# EAGLE design InitialTransceivers (EAGLE 7.1.0)
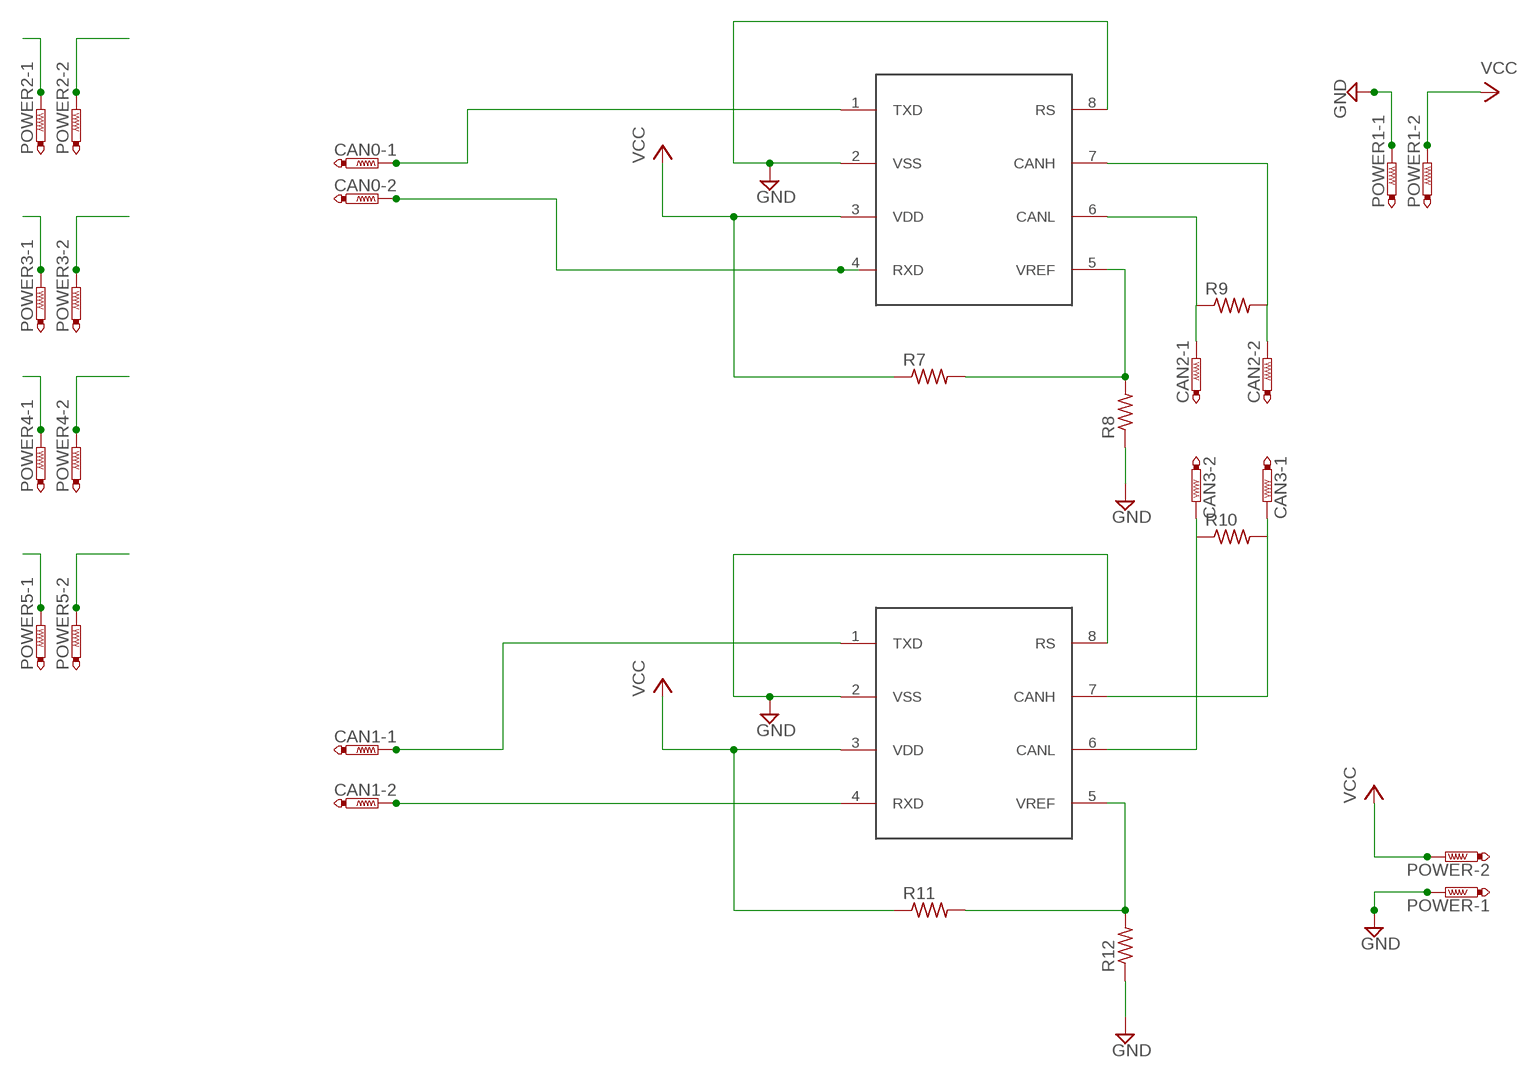
[diagram p0: schematic, sheet 1]

## Parts
CAN0  PTR2  [P2-38-17]
CAN1  PTR2  [P2-38-17]
CAN2  PTR2  [P2-38-17]
CAN3  PTR2  [P2-38-17]
POWER  PTR2  [P2-38-17]
POWER1  PTR2  [P2-38-17]
POWER2  PTR2  [P2-38-17]
POWER3  PTR2  [P2-38-17]
POWER4  PTR2  [P2-38-17]
POWER5  PTR2  [P2-38-17]
R7  R-US_0204/5  [0204/5]
R8  R-US_0204/5  [0204/5]
R9  R-US_0204/5  [0204/5]
R10  R-US_0204/5  [0204/5]
R11  R-US_0204/5  [0204/5]
R12  R-US_0204/5  [0204/5]
U$2  MCP2551-DIP  [DIL08]
U$3  MCP2551-DIP  [DIL08]

## Nets
A0: POWER2.TP-1 POWER3.TP-1
A1: POWER2.TP-2 POWER3.TP-2
A2: POWER4.TP-1 POWER5.TP-1
A3: POWER4.TP-2 POWER5.TP-2
CH: CAN3.TP-1 R10.2 U$3.7(CANH)
CL: CAN3.TP-2 R10.1 U$3.6(CANL)
GND: POWER1.TP-1 POWER.TP-1 R8.1 R12.1 U$2.2(VSS) U$2.8(RS) U$3.2(VSS) U$3.8(RS)
N$1: CAN2.TP-1 R9.1 U$2.6(CANL)
N$2: CAN2.TP-2 R9.2 U$2.7(CANH)
N$3: R7.2 R8.2 U$2.5(VREF)
N$7: R11.2 R12.2 U$3.5(VREF)
RX1: CAN0.TP-2 U$2.4(RXD)
RX2: CAN1.TP-2 U$3.4(RXD)
TX1: CAN0.TP-1 U$2.1(TXD)
TX2: CAN1.TP-1 U$3.1(TXD)
VCC: POWER1.TP-2 POWER.TP-2 R7.1 R11.1 U$2.3(VDD) U$3.3(VDD)

## Library data of the parts
CAN0 CAN1-CAN3 POWER POWER1-POWER5 = testpad:PTR2: TEST PIN
R7-R12 = resistor:R-US_: RESISTOR, American symbol
U$2 U$3 = Dash parts:MCP2551-DIP

## Board
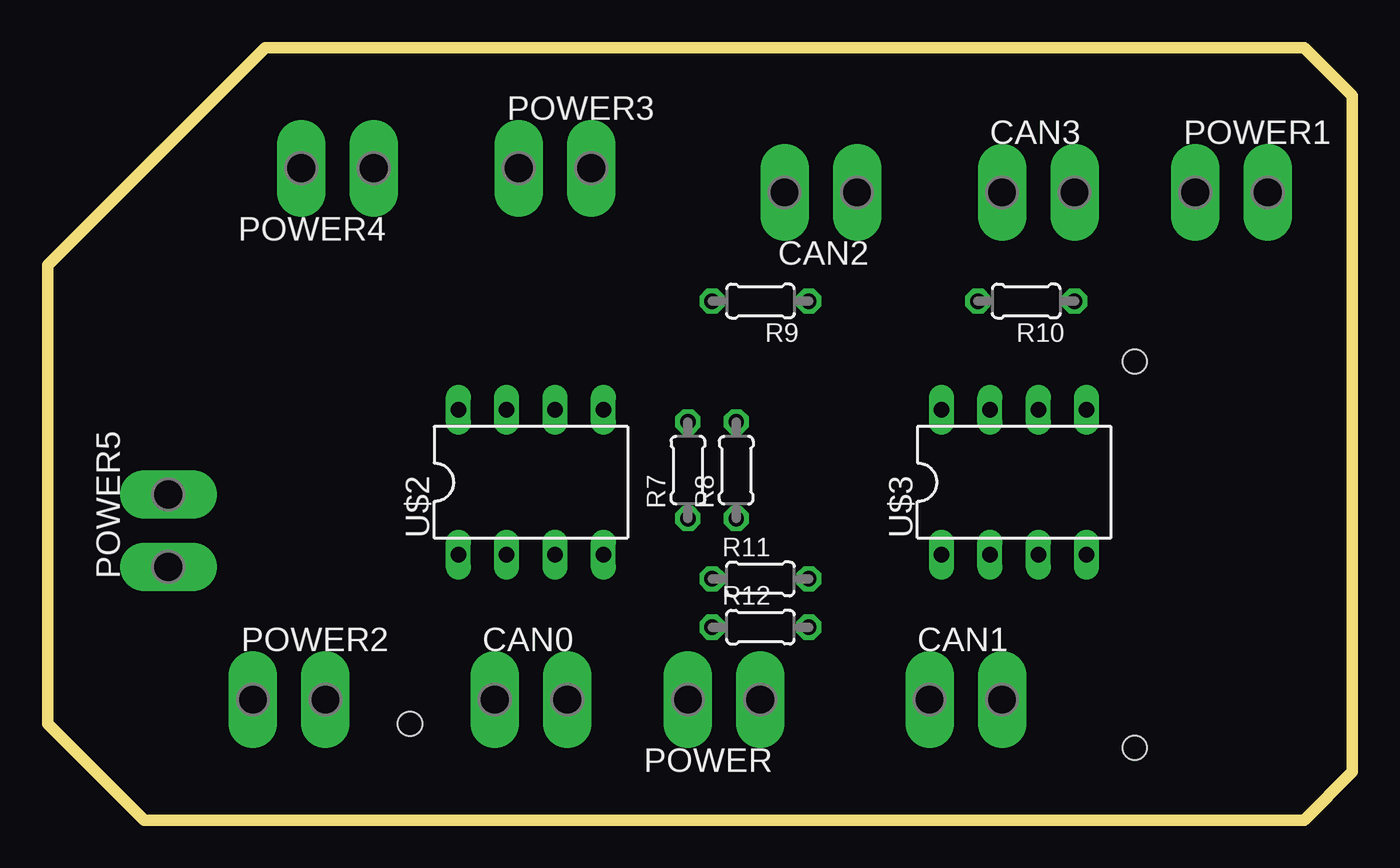
[diagram p1: board, top side]
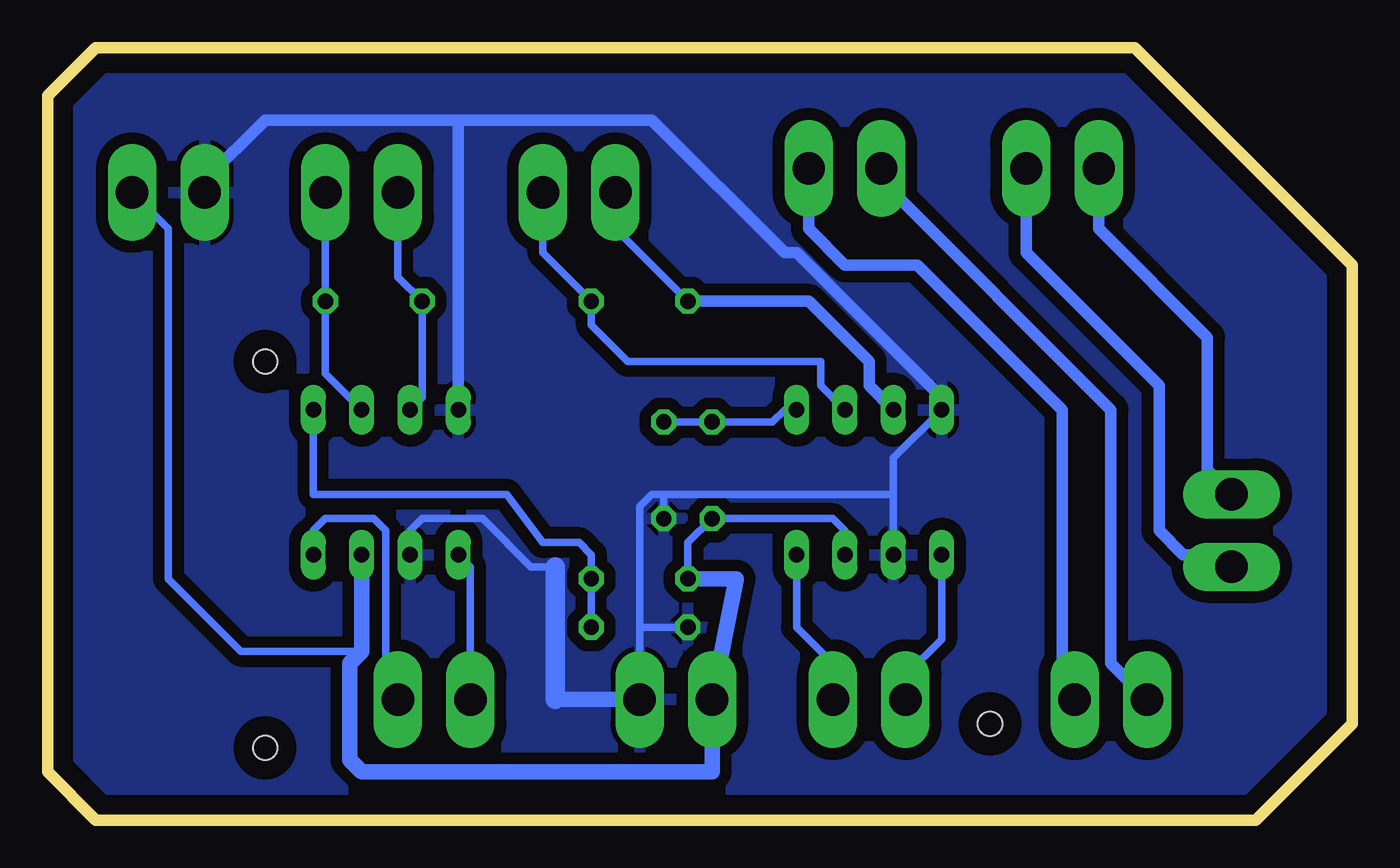
[diagram p2: board, bottom side, seen from below]

Size 68.58 x 40.64 mm. Coordinates in mm from the lower left corner, seen from the top.
Outline: 0,5.08 0,29.21 11.43,40.64 66.04,40.64 68.58,38.1 68.58,2.54 66.04,0 5.08,0 0,5.08
Copper layers (1*16): Top 0.035mm / dielectric 1.5mm / Bottom 0.035mm
Design rules "default": minimum track width 10mil, minimum drill 24mil, track to track 8mil, track to pad 8mil, pad to pad 8mil, via to via 8mil, smd to smd 8mil, copper to edge 40mil, drill to drill 8mil, minimum pad ring 10mil, minimum via ring 8mil, stop-mask expansion 4mil, vias tented up to drill 0mil, thermal gap 10mil
Holes 1.27 mm at 19.05,5.08 57.15,24.13 57.15,3.81

### Footprints (pad centres in the part's own frame; a part is rotated, then mirrored left to right if it is on the bottom)
P2-38-17 = drill 1.702 pad 2.121 long: TP-1 -1.905,0; TP-2 1.905,0
0204/5 = drill 0.813 octagon: 1 -2.54,0; 2 2.54,0
DIL08 = drill 0.813 long: 1 -3.81,-3.81; 2 -1.27,-3.81; 3 1.27,-3.81; 4 3.81,-3.81; 5 3.81,3.81; 6 1.27,3.81; 7 -1.27,3.81; 8 -3.81,3.81

### Placement (x,y rotation side)
CAN0  25.4,6.35 0 top
CAN1  48.26,6.35 0 top
CAN2  40.64,33.02 180 top
CAN3  52.07,33.02 0 top
POWER  35.56,6.35 180 top
POWER1  62.23,33.02 0 top
POWER2  12.7,6.35 0 top
POWER3  26.67,34.29 0 top
POWER4  15.24,34.29 180 top
POWER5  6.35,15.24 90 top
R7  33.66,18.41 90 top
R8  36.2,18.41 90 top
R9  37.47,27.3 180 top
R10  51.44,27.3 180 top
R11  37.47,12.7 0 top
R12  37.47,10.16 0 top
U$2  25.4,17.78 0 top
U$3  50.8,17.78 0 top

### Tracks (layer width: path | path; a pad name or v marks a point on that pad's centre or on a via)
A0
  Bottom 0.61: POWER2.TP-1 12.7,8.26 12.7,21.59 24.77,33.66 POWER3.TP-1
A1
  Bottom 0.61: POWER2.TP-2 15.24,6.98 15.24,21.59 22.86,29.21 26.67,29.21 28.57,31.11 POWER3.TP-2
A2
  Bottom 0.61: POWER5.TP-1 6.98,13.97 8.89,13.97 10.16,15.24 10.16,22.86 17.14,29.84 POWER4.TP-1
A3
  Bottom 0.61: POWER5.TP-2 7.62,18.41 7.62,25.4 13.34,31.11 POWER4.TP-2
CH
  Bottom 0.406: U$3.7 48.9,22.22 R10.2 50.17,28.57 CAN3.TP-1
CL
  Bottom 0.406: U$3.6 53.98,23.5 R10.1 CAN3.TP-2
GND
  Bottom 0.406: U$2.8 24.13,19.05 24.13,17.14 | 24.13,17.14 U$2.2 | POWER.TP-1 37.47,10.16 | 37.47,10.16 37.47,16.51 36.83,17.14 36.2,17.14 | 36.2,17.14 24.13,17.14 | R12.1 37.47,10.16 | R8.1 36.2,17.14 | U$3.2 49.53,15.24 48.9,15.88 45.72,15.88 43.18,13.33 41.91,13.33
  Bottom 0.61: POWER1.TP-1 60.33,33.66 57.15,36.83 46.99,36.83 | 46.99,36.83 36.83,36.83 29.85,29.84 29.21,29.84 21.59,22.22 U$2.8 | U$3.8 46.99,36.83
  Bottom 0.813: 41.91,6.35 POWER.TP-1
  Bottom 1.016: 41.91,13.33 41.91,6.35
  pour Bottom (isolate 0.61): 1.27,0 0,29.21 11.43,40.64 66.04,40.64 68.58,38.1 68.58,2.54 66.04,0
N$1
  Bottom 0.406: U$2.6 27.94,22.86 27.94,24.13 38.1,24.13 40.01,26.04 R9.1 42.55,29.84 CAN2.TP-1
N$2
  Bottom 0.406: R9.2 38.73,31.11 CAN2.TP-2
  Bottom 0.61: U$2.7 25.4,22.86 25.4,24.13 28.57,27.3 R9.2
N$3
  Bottom 0.406: R8.2 R7.2 30.48,20.95 29.85,21.59 U$2.5
N$7
  Bottom 0.406: U$3.5 54.61,17.14 44.45,17.14 42.55,14.61 40.64,14.61 40.01,13.97 R11.2 R12.2
RX1
  Bottom 0.406: U$2.4 29.21,10.16 27.31,8.26 CAN0.TP-2
RX2
  Bottom 0.406: CAN1.TP-2 50.8,6.98 50.8,15.24 51.44,15.88 53.98,15.88 54.61,15.24 U$3.4
TX1
  Bottom 0.406: U$2.1 21.59,9.53 23.5,7.62 CAN0.TP-1
TX2
  Bottom 0.406: U$3.1 46.36,13.33 CAN1.TP-1
VCC
  Bottom 0.406: U$2.3 26.67,15.24 27.31,15.88 R7.1 34.92,14.61 R11.1 | POWER1.TP-2 62.23,31.11 62.23,12.7 58.42,8.89 52.07,8.89
  Bottom 0.813: U$3.3 52.07,8.89 52.7,8.26 52.7,3.17 52.07,2.54 33.66,2.54 POWER.TP-2 32.39,12.7 R11.1